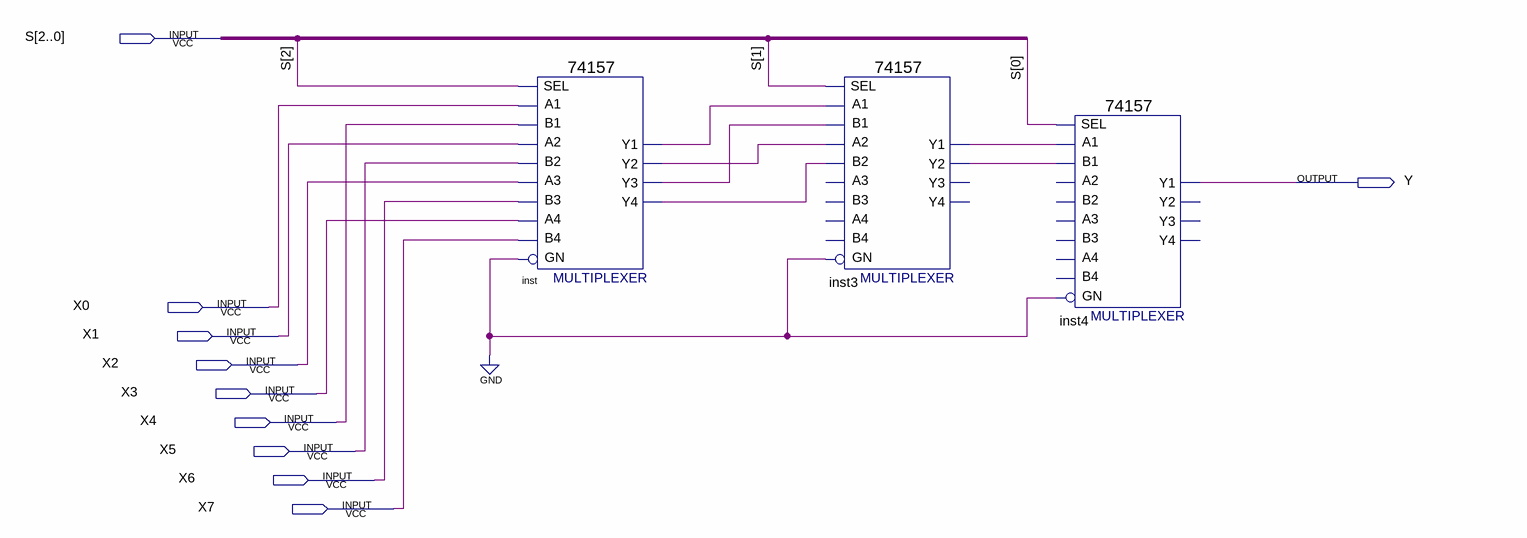
[diagram p0: schematic sheet]
// Quartus schematic questao1.bdf as structural Verilog: 3 symbols, 10 pins
module questao1 (
  input  [2:0] S,
  input  X0,
  input  X1,
  input  X2,
  input  X3,
  input  X4,
  input  X5,
  input  X6,
  input  X7,
  output Y
);

  wire inst3_y1, inst3_y2, inst_y1, inst_y2, inst_y3, inst_y4;

  \74157  inst (
    .A1(X0), .B1(X4), .SEL(S[2]), .B2(X5), .A3(X2), .B3(X6), .A2(X1), .B4(X7), .GN(1'b0), .A4(X3),
    .Y2(inst_y2), .Y1(inst_y1), .Y4(inst_y4), .Y3(inst_y3));
  \74157  inst3 (
    .A1(inst_y1), .B1(inst_y3), .SEL(S[1]), .B2(inst_y4), .A2(inst_y2), .GN(1'b0), .Y2(inst3_y2),
    .Y1(inst3_y1));  // open: A3, B3, B4, A4, Y4, Y3
  \74157  inst4 (
    .A1(inst3_y1), .B1(inst3_y2), .SEL(S[0]), .GN(1'b0), .Y1(Y));  // open: B2, A3, B3, A2, B4, A4, Y2, Y4, Y3
endmodule
